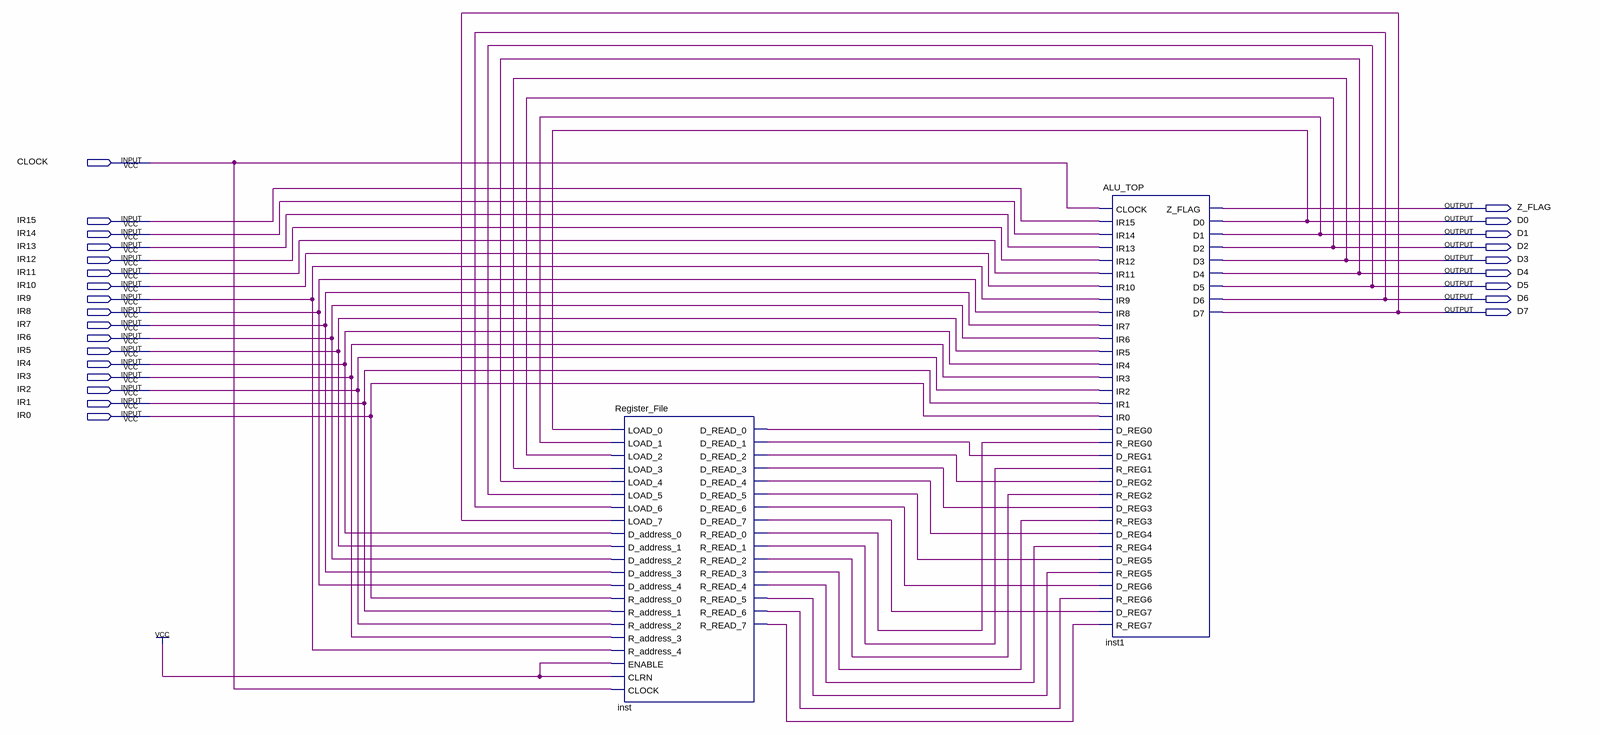
[diagram p0: schematic sheet]
// Quartus schematic ALU_REG_TEST.bdf as structural Verilog: 2 symbols, 26 pins
module ALU_REG_TEST (
  input  CLOCK,
  input  IR15,
  input  IR14,
  input  IR13,
  input  IR12,
  input  IR11,
  input  IR10,
  input  IR9,
  input  IR8,
  input  IR7,
  input  IR6,
  input  IR5,
  input  IR4,
  input  IR3,
  input  IR2,
  input  IR1,
  input  IR0,
  output Z_FLAG,
  output D0,
  output D1,
  output D2,
  output D3,
  output D4,
  output D5,
  output D6,
  output D7
);

  wire inst_d_read_0, inst_d_read_1, inst_d_read_2, inst_d_read_3, inst_d_read_4, inst_d_read_5,
       inst_d_read_6, inst_d_read_7, inst_r_read_0, inst_r_read_1, inst_r_read_2, inst_r_read_3,
       inst_r_read_4, inst_r_read_5, inst_r_read_6, inst_r_read_7;

  Register_File inst (
    .LOAD_0(D0), .LOAD_1(D1), .LOAD_2(D2), .LOAD_3(D3), .LOAD_4(D4), .LOAD_5(D5), .LOAD_6(D6), .LOAD_7(D7),
    .D_address_0(IR4), .D_address_1(IR5), .D_address_2(IR6), .D_address_3(IR7), .D_address_4(IR8),
    .R_address_0(IR0), .R_address_1(IR1), .R_address_2(IR2), .R_address_3(IR3), .R_address_4(IR9),
    .ENABLE(1'b1), .CLRN(1'b1), .CLOCK(CLOCK), .D_READ_0(inst_d_read_0), .D_READ_1(inst_d_read_1),
    .D_READ_2(inst_d_read_2), .D_READ_3(inst_d_read_3), .D_READ_4(inst_d_read_4), .D_READ_5(inst_d_read_5),
    .D_READ_6(inst_d_read_6), .D_READ_7(inst_d_read_7), .R_READ_0(inst_r_read_0), .R_READ_1(inst_r_read_1),
    .R_READ_2(inst_r_read_2), .R_READ_3(inst_r_read_3), .R_READ_4(inst_r_read_4), .R_READ_5(inst_r_read_5),
    .R_READ_6(inst_r_read_6), .R_READ_7(inst_r_read_7));
  ALU_TOP inst1 (
    .CLOCK(CLOCK), .IR15(IR15), .IR14(IR14), .IR13(IR13), .IR12(IR12), .IR11(IR11), .IR10(IR10), .IR9(IR9),
    .IR8(IR8), .IR7(IR7), .IR6(IR6), .IR5(IR5), .IR4(IR4), .IR3(IR3), .IR2(IR2), .IR1(IR1), .IR0(IR0),
    .D_REG0(inst_d_read_0), .R_REG0(inst_r_read_0), .D_REG1(inst_d_read_1), .R_REG1(inst_r_read_1),
    .D_REG2(inst_d_read_2), .R_REG2(inst_r_read_2), .D_REG3(inst_d_read_3), .R_REG3(inst_r_read_3),
    .D_REG4(inst_d_read_4), .R_REG4(inst_r_read_4), .D_REG5(inst_d_read_5), .R_REG5(inst_r_read_5),
    .D_REG6(inst_d_read_6), .R_REG6(inst_r_read_6), .D_REG7(inst_d_read_7), .R_REG7(inst_r_read_7),
    .Z_FLAG(Z_FLAG), .D0(D0), .D1(D1), .D2(D2), .D3(D3), .D4(D4), .D5(D5), .D6(D6), .D7(D7));
endmodule
